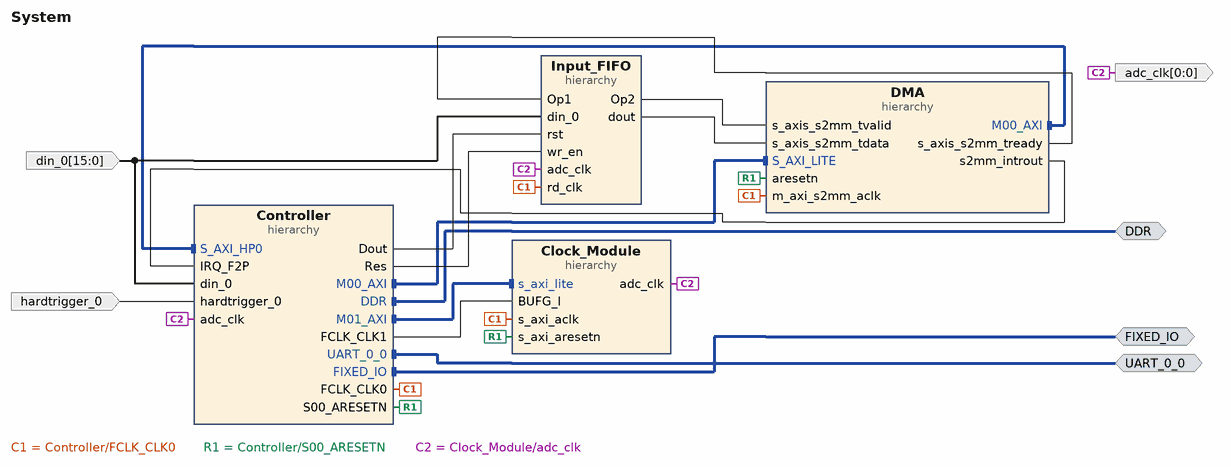
[diagram p0: block diagram of the top level]
# Vivado block design System, xc7z020clg484-1, Vivado 2018.3
create_bd_design System

create_bd_intf_port -mode Master -vlnv xilinx.com:interface:ddrx_rtl:1.0 DDR
create_bd_intf_port -mode Master -vlnv xilinx.com:display_processing_system7:fixedio_rtl:1.0 FIXED_IO
create_bd_intf_port -mode Master -vlnv xilinx.com:interface:uart_rtl:1.0 UART_0_0
create_bd_port -dir I -from 15 -to 0 din_0
create_bd_port -dir O -from 0 -to 0 adc_clk
create_bd_port -dir I hardtrigger_0

create_bd_cell -type hier DMA
create_bd_cell -type hier Input_FIFO
create_bd_cell -type hier Clock_Module
create_bd_cell -type hier Controller

# ---- hierarchy /DMA ----
current_bd_instance /DMA
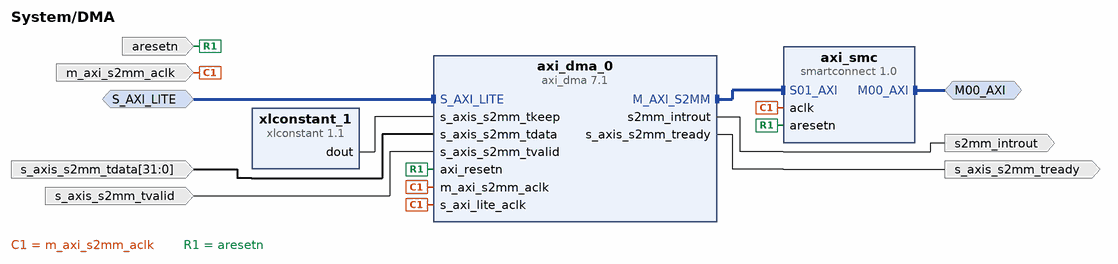
[diagram p1: block diagram inside /DMA]
create_bd_intf_pin -mode Slave -vlnv xilinx.com:interface:aximm_rtl:1.0 S_AXI_LITE
create_bd_intf_pin -mode Master -vlnv xilinx.com:interface:aximm_rtl:1.0 M00_AXI
create_bd_pin -dir I -type clk m_axi_s2mm_aclk
create_bd_pin -dir I -type rst aresetn
create_bd_pin -dir I -from 31 -to 0 s_axis_s2mm_tdata
create_bd_pin -dir I s_axis_s2mm_tvalid
create_bd_pin -dir O s_axis_s2mm_tready
create_bd_pin -dir O -type intr s2mm_introut

create_bd_cell -type ip -vlnv xilinx.com:ip:axi_dma:7.1 axi_dma_0
set_property -dict [list \
  CONFIG.c_include_mm2s 0 \
  CONFIG.c_include_s2mm_dre 1 \
  CONFIG.c_include_sg 0 \
  CONFIG.c_s2mm_burst_size 64 \
  CONFIG.c_sg_length_width 26 \
] [get_bd_cells axi_dma_0]
create_bd_cell -type ip -vlnv xilinx.com:ip:xlconstant:1.1 xlconstant_1
set_property -dict {CONFIG.CONST_VAL 0xF CONFIG.CONST_WIDTH 4} [get_bd_cells xlconstant_1]
create_bd_cell -type ip -vlnv xilinx.com:ip:smartconnect:1.0 axi_smc
set_property -dict {CONFIG.NUM_SI 3} [get_bd_cells axi_smc]

# ---- hierarchy /Input_FIFO ----
current_bd_instance /Input_FIFO
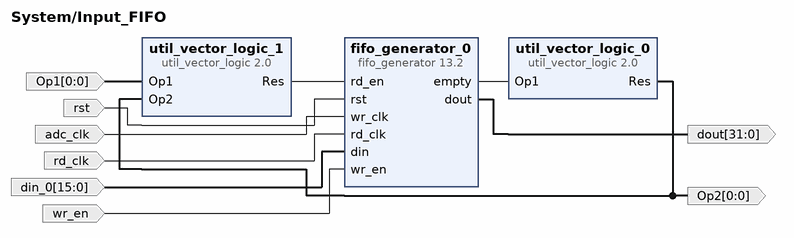
[diagram p2: block diagram inside /Input_FIFO]
create_bd_pin -dir O -from 0 -to 0 Op2
create_bd_pin -dir I rst
create_bd_pin -dir I -type clk adc_clk
create_bd_pin -dir I -type clk rd_clk
create_bd_pin -dir I -from 15 -to 0 din_0
create_bd_pin -dir I wr_en
create_bd_pin -dir O -from 31 -to 0 dout
create_bd_pin -dir I -from 0 -to 0 Op1

create_bd_cell -type ip -vlnv xilinx.com:ip:util_vector_logic:2.0 util_vector_logic_0
set_property -dict {CONFIG.C_OPERATION not CONFIG.C_SIZE 1} [get_bd_cells util_vector_logic_0]
create_bd_cell -type ip -vlnv xilinx.com:ip:fifo_generator:13.2 fifo_generator_0
set_property -dict [list \
  CONFIG.Empty_Threshold_Assert_Value 50 \
  CONFIG.Enable_Safety_Circuit true \
  CONFIG.Fifo_Implementation Independent_Clocks_Block_RAM \
  CONFIG.Full_Flags_Reset_Value 1 \
  CONFIG.Input_Data_Width 16 \
  CONFIG.Output_Data_Width 32 \
  CONFIG.Programmable_Empty_Type Single_Programmable_Empty_Threshold_Constant \
] [get_bd_cells fifo_generator_0]
create_bd_cell -type ip -vlnv xilinx.com:ip:util_vector_logic:2.0 util_vector_logic_1
set_property -dict {CONFIG.C_SIZE 1} [get_bd_cells util_vector_logic_1]

# ---- hierarchy /Clock_Module ----
current_bd_instance /Clock_Module
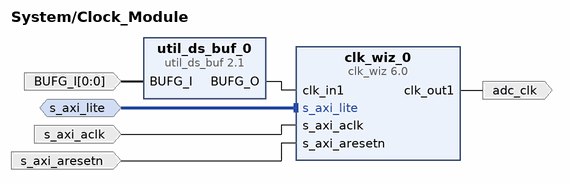
[diagram p3: block diagram inside /Clock_Module]
create_bd_intf_pin -mode Slave -vlnv xilinx.com:interface:aximm_rtl:1.0 s_axi_lite
create_bd_pin -dir I -type clk s_axi_aclk
create_bd_pin -dir I -type rst s_axi_aresetn
create_bd_pin -dir O -type clk adc_clk
create_bd_pin -dir I -from 0 -to 0 -type clk BUFG_I

create_bd_cell -type ip -vlnv xilinx.com:ip:clk_wiz:6.0 clk_wiz_0
set_property -dict [list \
  CONFIG.CLKIN1_JITTER_PS 200.0 \
  CONFIG.CLKOUT1_JITTER 943.481 \
  CONFIG.CLKOUT1_PHASE_ERROR 919.522 \
  CONFIG.CLKOUT1_REQUESTED_OUT_FREQ 5 \
  CONFIG.MMCM_CLKFBOUT_MULT_F 64.000 \
  CONFIG.MMCM_CLKIN1_PERIOD 20.000 \
  CONFIG.MMCM_CLKIN2_PERIOD 10.0 \
  CONFIG.MMCM_CLKOUT0_DIVIDE_F 128.000 \
  CONFIG.MMCM_DIVCLK_DIVIDE 5 \
  CONFIG.PRIM_IN_FREQ 50 \
  CONFIG.USE_DYN_RECONFIG true \
] [get_bd_cells clk_wiz_0]
create_bd_cell -type ip -vlnv xilinx.com:ip:util_ds_buf:2.1 util_ds_buf_0
set_property -dict {CONFIG.C_BUF_TYPE BUFG} [get_bd_cells util_ds_buf_0]

# ---- hierarchy /Controller ----
current_bd_instance /Controller
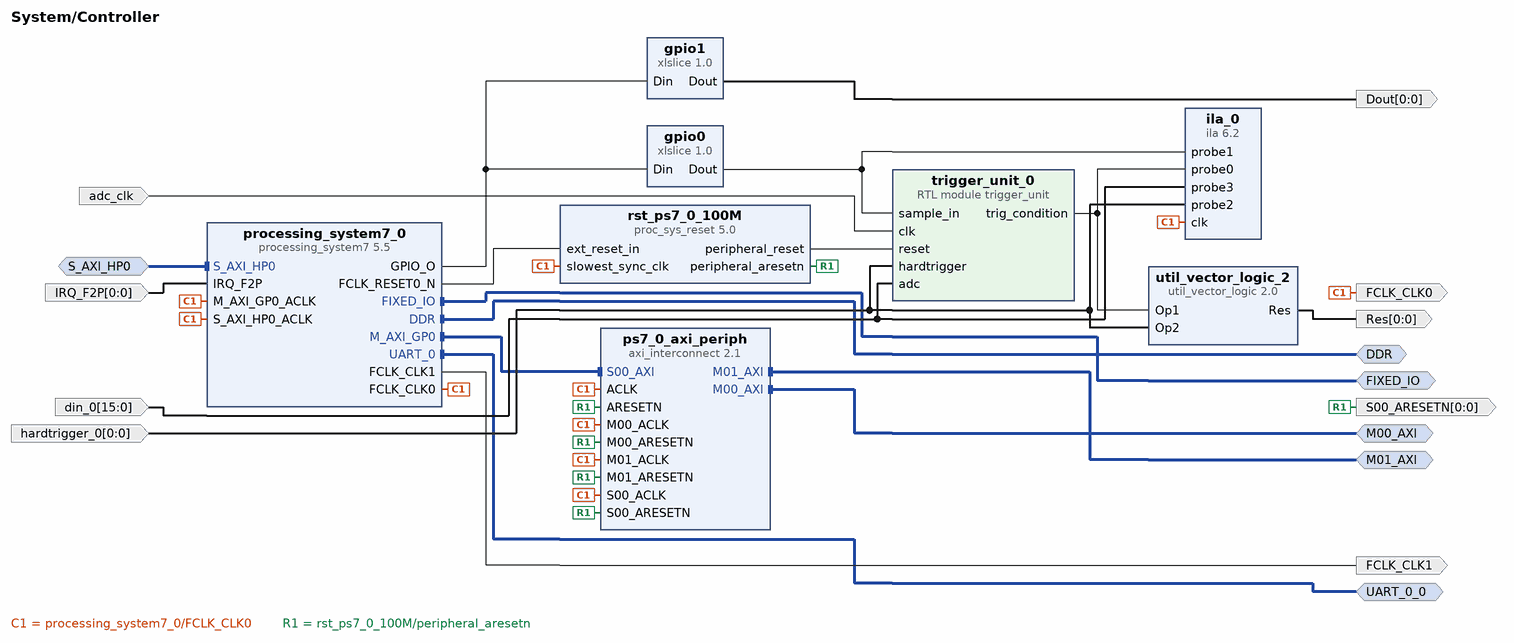
[diagram p4: block diagram inside /Controller]
create_bd_intf_pin -mode Master -vlnv xilinx.com:interface:ddrx_rtl:1.0 DDR
create_bd_intf_pin -mode Master -vlnv xilinx.com:display_processing_system7:fixedio_rtl:1.0 FIXED_IO
create_bd_intf_pin -mode Master -vlnv xilinx.com:interface:uart_rtl:1.0 UART_0_0
create_bd_intf_pin -mode Slave -vlnv xilinx.com:interface:aximm_rtl:1.0 S_AXI_HP0
create_bd_intf_pin -mode Master -vlnv xilinx.com:interface:aximm_rtl:1.0 M00_AXI
create_bd_intf_pin -mode Master -vlnv xilinx.com:interface:aximm_rtl:1.0 M01_AXI
create_bd_pin -dir O -type clk FCLK_CLK0
create_bd_pin -dir I -from 0 -to 0 -type intr IRQ_F2P
create_bd_pin -dir O -type clk FCLK_CLK1
create_bd_pin -dir I -type clk adc_clk
create_bd_pin -dir I -from 15 -to 0 din_0
create_bd_pin -dir I -from 0 -to 0 hardtrigger_0
create_bd_pin -dir O -from 0 -to 0 Dout
create_bd_pin -dir O -from 0 -to 0 -type rst S00_ARESETN
create_bd_pin -dir O -from 0 -to 0 Res

create_bd_cell -type ip -vlnv xilinx.com:ip:processing_system7:5.5 processing_system7_0
set_property -dict [list \
  CONFIG.PCW_APU_PERIPHERAL_FREQMHZ 666.666666 \
  CONFIG.PCW_ENET0_PERIPHERAL_ENABLE 0 \
  CONFIG.PCW_EN_CLK1_PORT 1 \
  CONFIG.PCW_FPGA0_PERIPHERAL_FREQMHZ 100 \
  CONFIG.PCW_FPGA1_PERIPHERAL_FREQMHZ 50 \
  CONFIG.PCW_FPGA_FCLK1_ENABLE 1 \
  CONFIG.PCW_GPIO_EMIO_GPIO_ENABLE 1 \
  CONFIG.PCW_GPIO_EMIO_GPIO_IO 33 \
  CONFIG.PCW_GPIO_EMIO_GPIO_WIDTH 33 \
  CONFIG.PCW_GPIO_MIO_GPIO_ENABLE 0 \
  CONFIG.PCW_IRQ_F2P_INTR 1 \
  CONFIG.PCW_PERIPHERAL_BOARD_PRESET None \
  CONFIG.PCW_PRESET_BANK1_VOLTAGE {LVCMOS 3.3V} \
  CONFIG.PCW_QSPI_GRP_FBCLK_ENABLE 1 \
  CONFIG.PCW_QSPI_GRP_FBCLK_IO {MIO 8} \
  CONFIG.PCW_QSPI_GRP_SINGLE_SS_ENABLE 1 \
  CONFIG.PCW_QSPI_GRP_SINGLE_SS_IO {MIO 1 .. 6} \
  CONFIG.PCW_QSPI_PERIPHERAL_ENABLE 1 \
  CONFIG.PCW_QSPI_QSPI_IO {MIO 1 .. 6} \
  CONFIG.PCW_SD0_PERIPHERAL_ENABLE 0 \
  CONFIG.PCW_SINGLE_QSPI_DATA_MODE x4 \
  CONFIG.PCW_UART0_PERIPHERAL_ENABLE 1 \
  CONFIG.PCW_UART0_UART0_IO EMIO \
  CONFIG.PCW_UART1_PERIPHERAL_ENABLE 0 \
  CONFIG.PCW_UART_PERIPHERAL_FREQMHZ 100 \
  CONFIG.PCW_UIPARAM_DDR_BUS_WIDTH {16 Bit} \
  CONFIG.PCW_UIPARAM_DDR_FREQ_MHZ 533.333333 \
  CONFIG.PCW_UIPARAM_DDR_PARTNO {MT41K256M16 RE-125} \
  CONFIG.PCW_USB0_PERIPHERAL_ENABLE 0 \
  CONFIG.PCW_USE_FABRIC_INTERRUPT 1 \
  CONFIG.PCW_USE_S_AXI_HP0 1 \
] [get_bd_cells processing_system7_0]
# 357 more settings of processing_system7_0 are not shown: defaults, MIO pin electricals, DDR timing, and values the tool derives
create_bd_cell -type module -reference trigger_unit trigger_unit_0
create_bd_cell -type ip -vlnv xilinx.com:ip:ila:6.2 ila_0
set_property -dict [list \
  CONFIG.ALL_PROBE_SAME_MU_CNT 2 \
  CONFIG.C_ADV_TRIGGER true \
  CONFIG.C_ENABLE_ILA_AXI_MON false \
  CONFIG.C_EN_STRG_QUAL 1 \
  CONFIG.C_MONITOR_TYPE Native \
  CONFIG.C_NUM_OF_PROBES 4 \
  CONFIG.C_PROBE0_MU_CNT 2 \
  CONFIG.C_PROBE0_WIDTH 1 \
  CONFIG.C_PROBE1_MU_CNT 2 \
  CONFIG.C_PROBE1_WIDTH 24 \
  CONFIG.C_PROBE2_MU_CNT 2 \
  CONFIG.C_PROBE3_MU_CNT 2 \
  CONFIG.C_PROBE3_WIDTH 16 \
] [get_bd_cells ila_0]
create_bd_cell -type ip -vlnv xilinx.com:ip:xlslice:1.0 gpio0
set_property -dict {CONFIG.DIN_FROM 23 CONFIG.DIN_TO 0 CONFIG.DIN_WIDTH 33 CONFIG.DOUT_WIDTH 24} [get_bd_cells gpio0]
create_bd_cell -type ip -vlnv xilinx.com:ip:xlslice:1.0 gpio1
set_property -dict {CONFIG.DIN_FROM 32 CONFIG.DIN_TO 32 CONFIG.DIN_WIDTH 33 CONFIG.DOUT_WIDTH 1} [get_bd_cells gpio1]
create_bd_cell -type ip -vlnv xilinx.com:ip:proc_sys_reset:5.0 rst_ps7_0_100M
create_bd_cell -type ip -vlnv xilinx.com:ip:util_vector_logic:2.0 util_vector_logic_2
set_property -dict {CONFIG.C_OPERATION or CONFIG.C_SIZE 1} [get_bd_cells util_vector_logic_2]
create_bd_cell -type ip -vlnv xilinx.com:ip:axi_interconnect:2.1 ps7_0_axi_periph
set_property -dict {CONFIG.NUM_MI 2} [get_bd_cells ps7_0_axi_periph]

# ---- connections ----

current_bd_instance /DMA
connect_bd_intf_net [get_bd_intf_pins axi_dma_0/M_AXI_S2MM] [get_bd_intf_pins axi_smc/S01_AXI]
connect_bd_intf_net [get_bd_intf_pins M00_AXI] [get_bd_intf_pins axi_smc/M00_AXI]
connect_bd_intf_net [get_bd_intf_pins S_AXI_LITE] [get_bd_intf_pins axi_dma_0/S_AXI_LITE]
connect_bd_net [get_bd_pins xlconstant_1/dout] [get_bd_pins axi_dma_0/s_axis_s2mm_tkeep]
connect_bd_net -net processing_system7_0_FCLK_CLK0 [get_bd_pins m_axi_s2mm_aclk] \
  [get_bd_pins axi_dma_0/m_axi_s2mm_aclk] [get_bd_pins axi_smc/aclk] [get_bd_pins axi_dma_0/s_axi_lite_aclk]
connect_bd_net -net rst_ps7_0_100M_peripheral_aresetn [get_bd_pins aresetn] [get_bd_pins axi_smc/aresetn] [get_bd_pins axi_dma_0/axi_resetn]
connect_bd_net -net fifo_generator_0_dout [get_bd_pins s_axis_s2mm_tdata] [get_bd_pins axi_dma_0/s_axis_s2mm_tdata]
connect_bd_net [get_bd_pins s_axis_s2mm_tvalid] [get_bd_pins axi_dma_0/s_axis_s2mm_tvalid]
connect_bd_net [get_bd_pins axi_dma_0/s_axis_s2mm_tready] [get_bd_pins s_axis_s2mm_tready]
connect_bd_net [get_bd_pins axi_dma_0/s2mm_introut] [get_bd_pins s2mm_introut]

current_bd_instance /Input_FIFO
connect_bd_net [get_bd_pins fifo_generator_0/empty] [get_bd_pins util_vector_logic_0/Op1]
connect_bd_net [get_bd_pins util_vector_logic_1/Res] [get_bd_pins fifo_generator_0/rd_en]
connect_bd_net [get_bd_pins util_vector_logic_0/Res] [get_bd_pins Op2] [get_bd_pins util_vector_logic_1/Op2]
connect_bd_net -net gpio1_Dout [get_bd_pins rst] [get_bd_pins fifo_generator_0/rst]
connect_bd_net -net clk_wiz_0_clk_out1 [get_bd_pins adc_clk] [get_bd_pins fifo_generator_0/wr_clk]
connect_bd_net -net processing_system7_0_FCLK_CLK0 [get_bd_pins rd_clk] [get_bd_pins fifo_generator_0/rd_clk]
connect_bd_net -net din_0_1 [get_bd_pins din_0] [get_bd_pins fifo_generator_0/din]
connect_bd_net -net util_vector_logic_2_Res1 [get_bd_pins wr_en] [get_bd_pins fifo_generator_0/wr_en]
connect_bd_net [get_bd_pins fifo_generator_0/dout] [get_bd_pins dout]
connect_bd_net -net axi_dma_0_s_axis_s2mm_tready1 [get_bd_pins Op1] [get_bd_pins util_vector_logic_1/Op1]

current_bd_instance /Clock_Module
connect_bd_intf_net [get_bd_intf_pins s_axi_lite] [get_bd_intf_pins clk_wiz_0/s_axi_lite]
connect_bd_net [get_bd_pins util_ds_buf_0/BUFG_O] [get_bd_pins clk_wiz_0/clk_in1]
connect_bd_net -net processing_system7_0_FCLK_CLK0 [get_bd_pins s_axi_aclk] [get_bd_pins clk_wiz_0/s_axi_aclk]
connect_bd_net -net rst_ps7_0_100M_peripheral_aresetn [get_bd_pins s_axi_aresetn] [get_bd_pins clk_wiz_0/s_axi_aresetn]
connect_bd_net [get_bd_pins clk_wiz_0/clk_out1] [get_bd_pins adc_clk]
connect_bd_net -net processing_system7_0_FCLK_CLK1 [get_bd_pins BUFG_I] [get_bd_pins util_ds_buf_0/BUFG_I]

current_bd_instance /Controller
connect_bd_intf_net [get_bd_intf_pins M01_AXI] [get_bd_intf_pins ps7_0_axi_periph/M01_AXI]
connect_bd_intf_net [get_bd_intf_pins M00_AXI] [get_bd_intf_pins ps7_0_axi_periph/M00_AXI]
connect_bd_intf_net [get_bd_intf_pins FIXED_IO] [get_bd_intf_pins processing_system7_0/FIXED_IO]
connect_bd_intf_net [get_bd_intf_pins DDR] [get_bd_intf_pins processing_system7_0/DDR]
connect_bd_intf_net [get_bd_intf_pins UART_0_0] [get_bd_intf_pins processing_system7_0/UART_0]
connect_bd_intf_net -intf_net axi_smc_M00_AXI [get_bd_intf_pins S_AXI_HP0] [get_bd_intf_pins processing_system7_0/S_AXI_HP0]
connect_bd_intf_net [get_bd_intf_pins processing_system7_0/M_AXI_GP0] [get_bd_intf_pins ps7_0_axi_periph/S00_AXI]
connect_bd_net [get_bd_pins processing_system7_0/GPIO_O] [get_bd_pins gpio0/Din] [get_bd_pins gpio1/Din]
connect_bd_net [get_bd_pins processing_system7_0/FCLK_RESET0_N] [get_bd_pins rst_ps7_0_100M/ext_reset_in]
connect_bd_net [get_bd_pins rst_ps7_0_100M/peripheral_reset] [get_bd_pins trigger_unit_0/reset]
connect_bd_net [get_bd_pins gpio0/Dout] [get_bd_pins ila_0/probe1] [get_bd_pins trigger_unit_0/sample_in]
connect_bd_net [get_bd_pins trigger_unit_0/trig_condition] [get_bd_pins ila_0/probe0] [get_bd_pins util_vector_logic_2/Op1]
connect_bd_net [get_bd_pins processing_system7_0/FCLK_CLK0] \
  [get_bd_pins FCLK_CLK0] [get_bd_pins ila_0/clk] [get_bd_pins rst_ps7_0_100M/slowest_sync_clk] \
  [get_bd_pins processing_system7_0/S_AXI_HP0_ACLK] [get_bd_pins ps7_0_axi_periph/ACLK] \
  [get_bd_pins ps7_0_axi_periph/S00_ACLK] [get_bd_pins ps7_0_axi_periph/M00_ACLK] [get_bd_pins ps7_0_axi_periph/M01_ACLK] \
  [get_bd_pins processing_system7_0/M_AXI_GP0_ACLK]
connect_bd_net -net axi_dma_0_s2mm_introut [get_bd_pins IRQ_F2P] [get_bd_pins processing_system7_0/IRQ_F2P]
connect_bd_net [get_bd_pins processing_system7_0/FCLK_CLK1] [get_bd_pins FCLK_CLK1]
connect_bd_net -net clk_wiz_0_clk_out1 [get_bd_pins adc_clk] [get_bd_pins trigger_unit_0/clk]
connect_bd_net -net din_0_1 [get_bd_pins din_0] [get_bd_pins ila_0/probe3] [get_bd_pins trigger_unit_0/adc]
connect_bd_net -net hardtrigger_0_1 [get_bd_pins hardtrigger_0] \
  [get_bd_pins util_vector_logic_2/Op2] [get_bd_pins ila_0/probe2] [get_bd_pins trigger_unit_0/hardtrigger]
connect_bd_net [get_bd_pins gpio1/Dout] [get_bd_pins Dout]
connect_bd_net [get_bd_pins rst_ps7_0_100M/peripheral_aresetn] \
  [get_bd_pins S00_ARESETN] [get_bd_pins ps7_0_axi_periph/S00_ARESETN] [get_bd_pins ps7_0_axi_periph/M00_ARESETN] \
  [get_bd_pins ps7_0_axi_periph/M01_ARESETN] [get_bd_pins ps7_0_axi_periph/ARESETN]
connect_bd_net [get_bd_pins util_vector_logic_2/Res] [get_bd_pins Res]

current_bd_instance /
connect_bd_intf_net -intf_net processing_system7_0_DDR [get_bd_intf_ports DDR] [get_bd_intf_pins Controller/DDR]
connect_bd_intf_net -intf_net axi_smc_M00_AXI [get_bd_intf_pins DMA/M00_AXI] [get_bd_intf_pins Controller/S_AXI_HP0]
connect_bd_intf_net -intf_net processing_system7_0_UART_0 [get_bd_intf_ports UART_0_0] [get_bd_intf_pins Controller/UART_0_0]
connect_bd_intf_net [get_bd_intf_pins Clock_Module/s_axi_lite] [get_bd_intf_pins Controller/M01_AXI]
connect_bd_intf_net [get_bd_intf_pins Controller/M00_AXI] [get_bd_intf_pins DMA/S_AXI_LITE]
connect_bd_intf_net -intf_net processing_system7_0_FIXED_IO [get_bd_intf_ports FIXED_IO] [get_bd_intf_pins Controller/FIXED_IO]
connect_bd_net -net processing_system7_0_FCLK_CLK0 [get_bd_pins Controller/FCLK_CLK0] \
  [get_bd_pins DMA/m_axi_s2mm_aclk] [get_bd_pins Input_FIFO/rd_clk] [get_bd_pins Clock_Module/s_axi_aclk]
connect_bd_net -net rst_ps7_0_100M_peripheral_aresetn [get_bd_pins Controller/S00_ARESETN] \
  [get_bd_pins DMA/aresetn] [get_bd_pins Clock_Module/s_axi_aresetn]
connect_bd_net -net axi_dma_0_s_axis_s2mm_tready1 [get_bd_pins DMA/s_axis_s2mm_tready] [get_bd_pins Input_FIFO/Op1]
connect_bd_net [get_bd_pins Input_FIFO/Op2] [get_bd_pins DMA/s_axis_s2mm_tvalid]
connect_bd_net -net clk_wiz_0_clk_out1 [get_bd_pins Clock_Module/adc_clk] \
  [get_bd_ports adc_clk] [get_bd_pins Input_FIFO/adc_clk] [get_bd_pins Controller/adc_clk]
connect_bd_net -net fifo_generator_0_dout [get_bd_pins Input_FIFO/dout] [get_bd_pins DMA/s_axis_s2mm_tdata]
connect_bd_net -net axi_dma_0_s2mm_introut [get_bd_pins DMA/s2mm_introut] [get_bd_pins Controller/IRQ_F2P]
connect_bd_net -net din_0_1 [get_bd_ports din_0] [get_bd_pins Input_FIFO/din_0] [get_bd_pins Controller/din_0]
connect_bd_net -net gpio1_Dout [get_bd_pins Controller/Dout] [get_bd_pins Input_FIFO/rst]
connect_bd_net -net hardtrigger_0_1 [get_bd_ports hardtrigger_0] [get_bd_pins Controller/hardtrigger_0]
connect_bd_net -net util_vector_logic_2_Res1 [get_bd_pins Controller/Res] [get_bd_pins Input_FIFO/wr_en]
connect_bd_net -net processing_system7_0_FCLK_CLK1 [get_bd_pins Controller/FCLK_CLK1] [get_bd_pins Clock_Module/BUFG_I]

# ---- address map ----
assign_bd_address -offset 0x40400000 -range 64K -target_address_space [get_bd_addr_spaces Controller/processing_system7_0/Data] [get_bd_addr_segs DMA/axi_dma_0/S_AXI_LITE/Reg]
assign_bd_address -offset 0x43C00000 -range 64K -target_address_space [get_bd_addr_spaces Controller/processing_system7_0/Data] [get_bd_addr_segs Clock_Module/clk_wiz_0/s_axi_lite/Reg]
assign_bd_address -offset 0x00000000 -range 512M -target_address_space [get_bd_addr_spaces DMA/axi_dma_0/Data_S2MM] [get_bd_addr_segs Controller/processing_system7_0/S_AXI_HP0/HP0_DDR_LOWOCM]

validate_bd_design
save_bd_design
